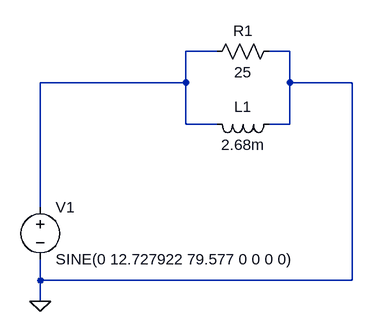
[diagram p0: schematic scheme8.asc]
scheme8.asc, the LTspice schematic file:
Version 4
SHEET 1 880 680
WIRE 448 -32 400 -32
WIRE 560 -32 528 -32
WIRE 400 16 400 -32
WIRE 400 16 176 16
WIRE 560 16 560 -32
WIRE 656 16 560 16
WIRE 400 80 400 16
WIRE 448 80 400 80
WIRE 560 80 560 16
WIRE 560 80 528 80
WIRE 176 208 176 16
WIRE 176 320 176 288
WIRE 656 320 656 16
WIRE 656 320 176 320
WIRE 176 352 176 320
FLAG 176 352 0
SYMBOL voltage 176 192 R0
WINDOW 123 0 0 Left 0
WINDOW 39 0 0 Left 0
SYMATTR InstName V1
SYMATTR Value SINE(0 12.727922 79.577 0 0 0 0)
SYMBOL ind 544 64 R90
WINDOW 0 5 56 VBottom 2
WINDOW 3 32 56 VTop 2
SYMATTR InstName L1
SYMATTR Value 2.68m
SYMBOL res 544 -48 R90
WINDOW 0 0 56 VBottom 2
WINDOW 3 32 56 VTop 2
SYMATTR InstName R1
SYMATTR Value 25

The netlist it stands for:
* scheme8.asc
V1 N001 0 SINE(0 12.727922 79.577 0 0 0 0)
L1 0 N001 2.68m
R1 0 N001 25
.backanno
.end